# EAGLE schematic untitled (EAGLE 6.5.0)
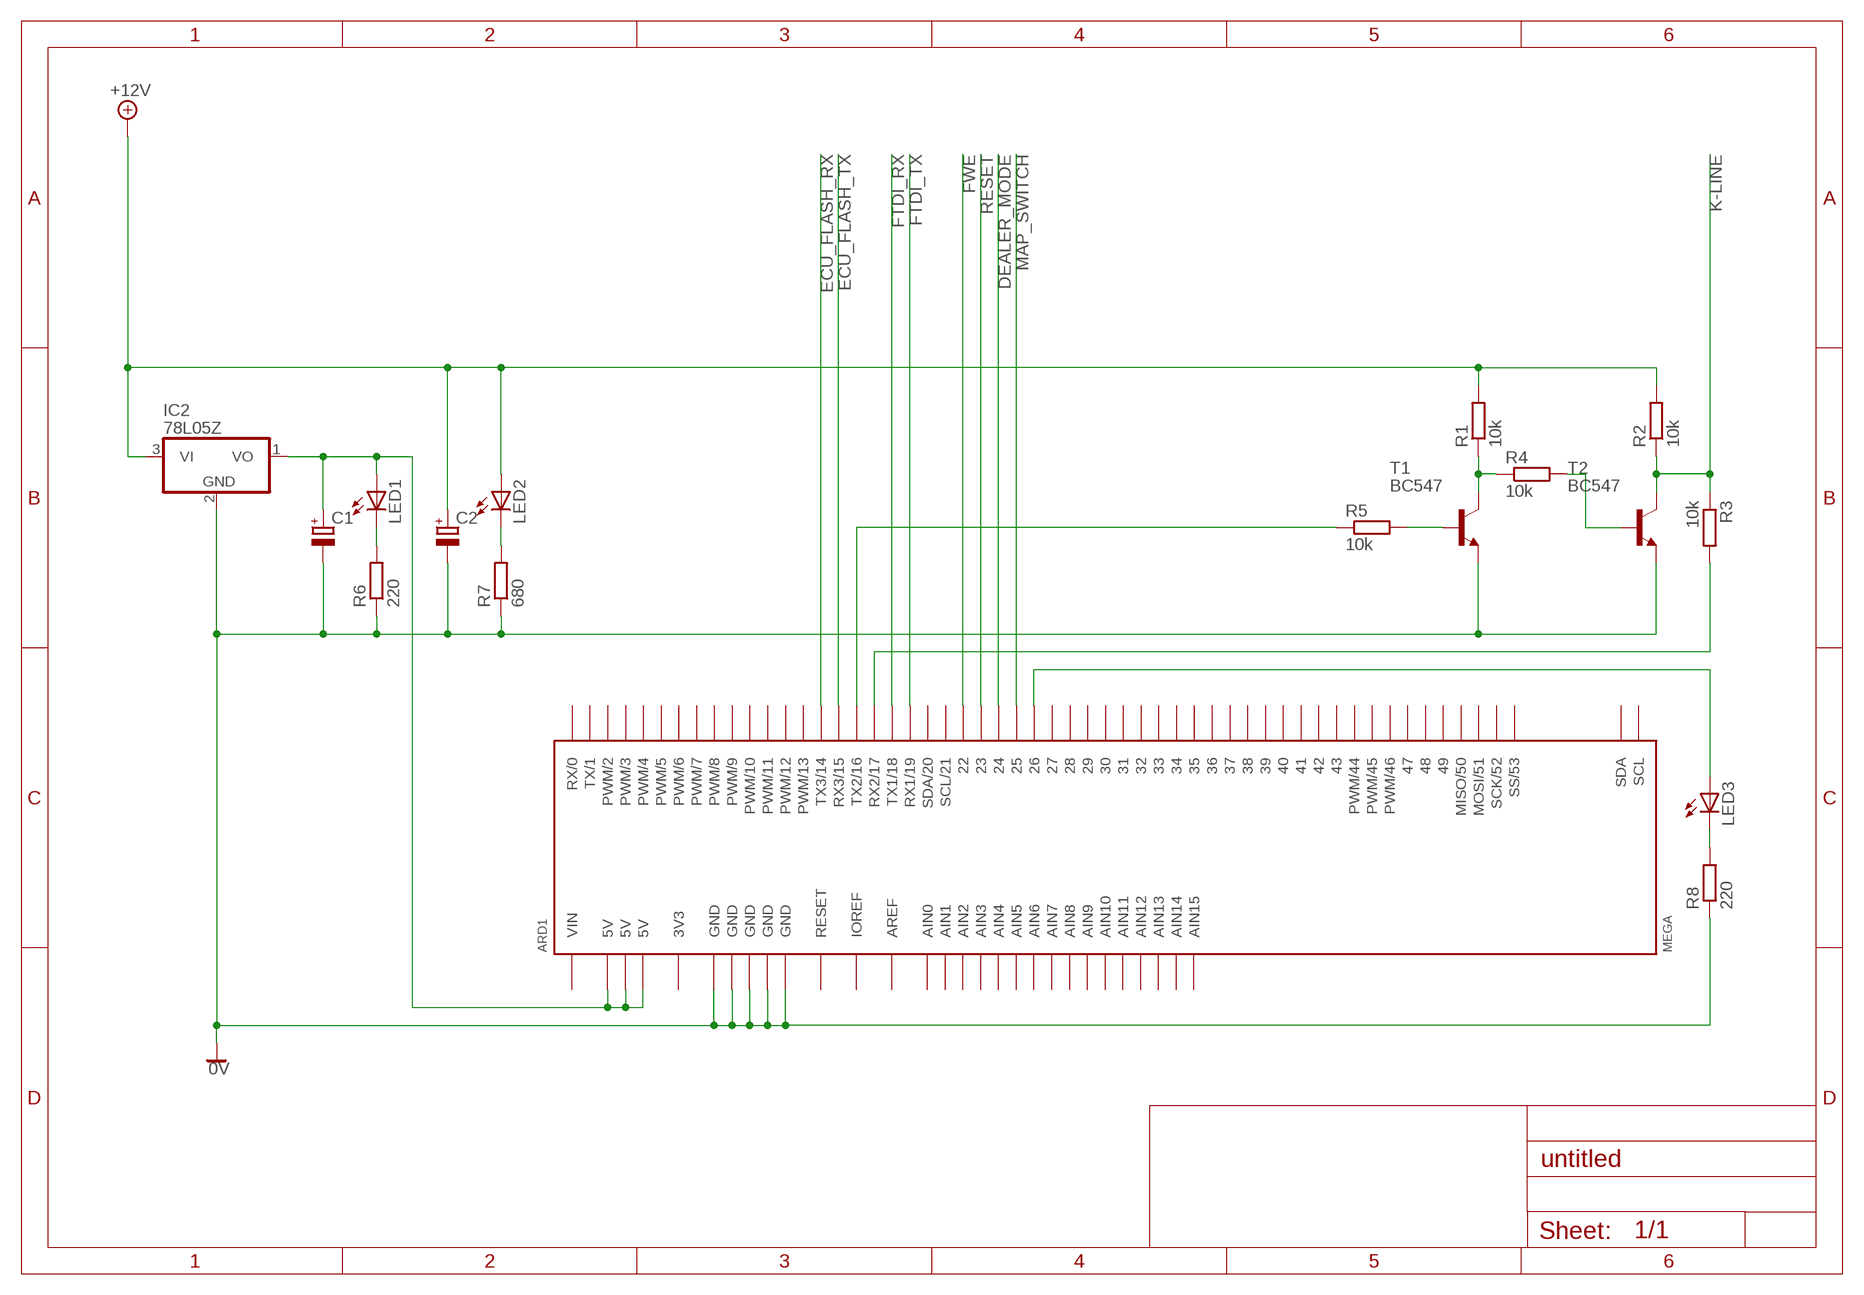
[diagram p0: schematic, sheet 1]

## Parts
ARD1  MEGA  [MEGA]
C1  CPOL-EUE1.8-4  [E1,8-4]
C2  CPOL-EUE1.8-4  [E1,8-4]
IC2  78L05Z  [TO92]
LED1  LED  [SMARTLED-TTW]
LED2  LED  [SMARTLED-TTW]
LED3  LED  [SMARTLED-TTW]
R1  10k  R-EU_0204/5  [0204/5]
R2  10k  R-EU_0204/5  [0204/5]
R3  10k  R-EU_0204/5  [0204/5]
R4  10k  R-EU_0204/5  [0204/5]
R5  10k  R-EU_0204/5  [0204/5]
R6  220  R-EU_0204/5  [0204/5]
R7  680  R-EU_0204/5  [0204/5]
R8  220  R-EU_0204/5  [0204/5]
T1  BC547  [TO92]
T2  BC547  [TO92]

## Nets
0V: ARD1.GND1(GND) ARD1.GND2(GND) ARD1.GND3(GND) ARD1.GND4(GND) ARD1.GND5(GND) C1.- C2.- IC2.2(GND) R6.1 R7.1 R8.1 T1.1(E) T2.1(E)
+12V: C2.+ IC2.3(VI) LED2.A@1(A) R1.2 R2.2
DEALER_MODE: ARD1.24
ECU_FLASH_RX: ARD1.14(TX3/14)
ECU_FLASH_TX: ARD1.15(RX3/15)
FTDI_RX: ARD1.18(TX1/18)
FTDI_TX: ARD1.19(RX1/19)
FWE: ARD1.22
K-LINE: R2.1 R3.1 T2.3(C)
MAP_SWITCH: ARD1.25
N$1: LED2.C@1(C) R7.2
N$2: LED1.C@1(C) R6.2
N$3: ARD1.5V1(5V) ARD1.5V2(5V) ARD1.5V3(5V) C1.+ IC2.1(VO) LED1.A@1(A)
N$4: ARD1.17(RX2/17) R3.2
N$5: R4.2 T2.2(B)
N$6: ARD1.26 LED3.A@1(A)
N$7: R1.1 R4.1 T1.3(C)
N$8: R5.2 T1.2(B)
N$9: ARD1.16(TX2/16) R5.1
N$10: LED3.C@1(C) R8.2
RESET: ARD1.23
Unconnected: ARD1.0(RX/0) ARD1.1(TX/1) ARD1.2(PWM/2) ARD1.3(PWM/3) ARD1.4(PWM/4) ARD1.5(PWM/5) ARD1.6(PWM/6) ARD1.7(PWM/7) ARD1.8(PWM/8) ARD1.9(PWM/9) ARD1.10(PWM/10) ARD1.11(PWM/11) ARD1.12(PWM/12) ARD1.13(PWM/13) ARD1.20(SDA/20) ARD1.21(SCL/21) ARD1.27 ARD1.28 ARD1.29 ARD1.30 ARD1.31 ARD1.32 ARD1.33 ARD1.34 ARD1.35 ARD1.36 ARD1.37 ARD1.38 ARD1.39 ARD1.40 ARD1.41 ARD1.42 ARD1.43 ARD1.44(PWM/44) ARD1.45(PWM/45) ARD1.46(PWM/46) ARD1.47 ARD1.48 ARD1.49 ARD1.50(MISO/50) ARD1.51(MOSI/51) ARD1.52(SCK/52) ARD1.53(SS/53) ARD1.AIN0 ARD1.AIN1 ARD1.AIN2 ARD1.AIN3 ARD1.AIN4 ARD1.AIN5 ARD1.AIN6 ARD1.AIN7 ARD1.AIN8 ARD1.AIN9 ARD1.AIN10 ARD1.AIN11 ARD1.AIN12 ARD1.AIN13 ARD1.AIN14 ARD1.AIN15 ARD1.RST(RESET) ARD1.SCL ARD1.SDA

## Power pins joined to a net without a drawn wire
3V3: ARD1.3V3
AREF: ARD1.AREF
IOREF: ARD1.IOREF
VIN: ARD1.VIN

## Library data of the parts
ARD1 = welectronic:MEGA: Arduino MEGA
C1 C2 = rcl:CPOL-EU: POLARIZED CAPACITOR, European symbol
IC2 = linear:78*: Positive VOLTAGE REGULATOR Source: http://cache.national.com/ds/LM/LM78L05.pdf http://www.fairchildsemi.com/ds/LM/LM7805.pdf
LED1-LED3 = led:LED: LED OSRAM: - CHIPLED LG R971, LG N971, LY N971, LG Q971, LY Q971, LO R971, LY R971 LH N974, LH R974 LS Q976, LO Q976, LY Q976 LO Q996 - Hyper CHIPLED LW Q18S LB Q993, LB Q99A, LB R99A - SideLED LS A670, LO A670, LY A670, LG A670, LP A670 LB A673, LV A673, LT A673, LW A673 LH A674 LY A675 LS A676, LA A676, LO A676, LY A676, LW A676 LS A679, LY A679, LG A679 - Hyper Micro SIDELED® LS Y876, LA Y876, LO Y876, LY Y876 LT Y87S - SmartLED LW L88C, LW L88S LB L89C, LB L89S, LG L890 LS L89K, LO L89K, LY L89K LS L896, LA L896, LO L896, LY L896 - TOPLED LS T670, LO T670, LY T670, LG T670, LP T670 LSG T670, LSP T670, LSY T670, LOP T670, LYG T670 LG T671, LOG T671, LSG T671 LB T673, LV T673, LT T673, LW T673 LH T674 LS T676, LA T676, LO T676, LY T676, LB T676, LH T676, LSB T676, LW T676 LB T67C, LV T67C, LT T67C, LS T67K, LO T67K, LY T67K, LW E67C LS E67B, LA E67B, LO E67B, LY E67B, LB E67C, LV E67C, LT E67C LW T67C LS T679, LY T679, LG T679 LS T770, LO T770, LY T770, LG T770, LP T770 LB T773, LV T773, LT T773, LW T773 LH T774 LS E675, LA E675, LY E675, LS T675 LS T776, LA T776, LO T776, LY T776, LB T776 LHGB T686 LT T68C, LB T68C - Hyper Mini TOPLED® LB M676 - Mini TOPLED Santana® LG M470 LS M47K, LO M47K, LY M47K Source: http://www.osram.convergy.de LUXEON: - LUMILED® LXK2-PW12-R00, LXK2-PW12-S00, LXK2-PW14-U00, LXK2-PW14-V00 LXK2-PM12-R00, LXK2-PM12-S00, LXK2-PM14-U00 LXK2-PE12-Q00, LXK2-PE12-R00, LXK2-PE12-S00, LXK2-PE14-T00, LXK2-PE14-U00 LXK2-PB12-K00, LXK2-PB12-L00, LXK2-PB12-M00, LXK2-PB14-N00, LXK2-PB14-P00, LXK2-PB14-Q00 LXK2-PR12-L00, LXK2-PR12-M00, LXK2-PR14-Q00, LXK2-PR14-R00 LXK2-PD12-Q00, LXK2-PD12-R00, LXK2-PD12-S00 LXK2-PH12-R00, LXK2-PH12-S00 LXK2-PL12-P00, LXK2-PL12-Q00, LXK2-PL12-R00 Source: www.luxeon.com KINGBRIGHT: KA-3528ASYC Source: www.kingbright.com
R1-R8 = rcl:R-EU_: RESISTOR, European symbol
T1 T2 = transistor:BC547: NPN TRANSISTOR